# EAGLE design Mainboard-v18 (EAGLE 6.4)
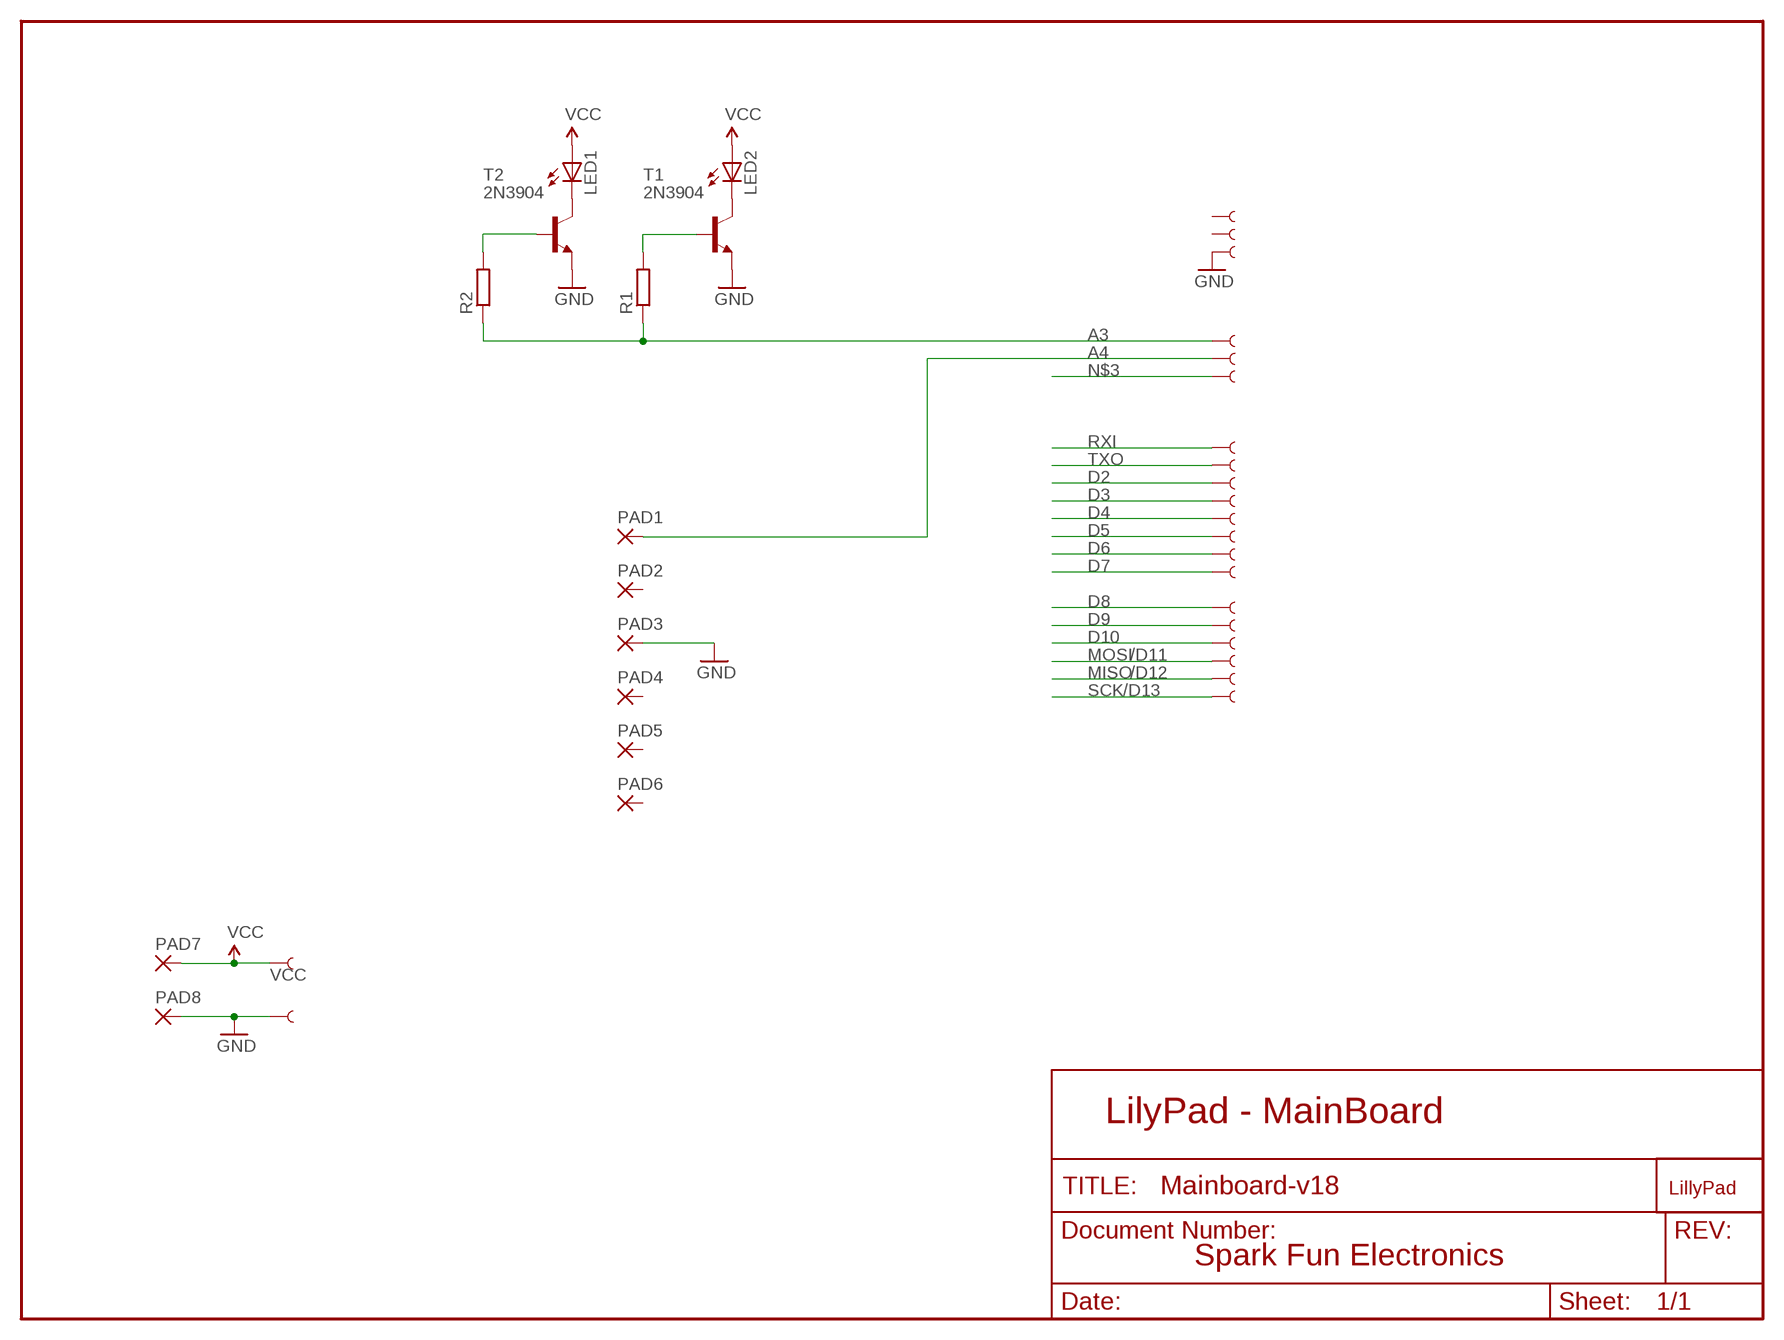
[diagram p0: schematic, sheet 1]

## Parts
GND  SEWTAP1  [SEWTAP]
LED1  LED5MM  [LED5MM]
LED2  LED5MM  [LED5MM]
PAD1  1,6/0,8  [1,6/0,8]
PAD2  1,6/0,8  [1,6/0,8]
PAD3  1,6/0,8  [1,6/0,8]
PAD4  1,6/0,8  [1,6/0,8]
PAD5  1,6/0,8  [1,6/0,8]
PAD6  1,6/0,8  [1,6/0,8]
PAD7  1,6/0,8  [1,6/0,8]
PAD8  1,6/0,8  [1,6/0,8]
R1  R-EU_0204/5  [0204/5]
R2  R-EU_0204/5  [0204/5]
T1  2N3904  [TO92]
T2  2N3904  [TO92]
U$1  LOGO-LPLPA  [LOGO-LPA]
U$4  SEWTAP1  [SEWTAP]
U$30  SEWTAP1  [SEWTAP]
U$31  SEWTAP1  [SEWTAP]
U$32  SEWTAP1  [SEWTAP]
U$33  SEWTAP1  [SEWTAP]
U$34  SEWTAP1  [SEWTAP]
U$35  SEWTAP1  [SEWTAP]
U$36  SEWTAP1  [SEWTAP]
U$37  SEWTAP1  [SEWTAP]
U$38  SEWTAP1  [SEWTAP]
U$39  SEWTAP1  [SEWTAP]
U$40  SEWTAP1  [SEWTAP]
U$41  SEWTAP1  [SEWTAP]
U$42  SEWTAP1  [SEWTAP]
U$43  SEWTAP1  [SEWTAP]
U$44  SEWTAP1  [SEWTAP]
U$45  SEWTAP1  [SEWTAP]
U$46  SEWTAP1  [SEWTAP]
U$47  SEWTAP1  [SEWTAP]
U$48  SEWTAP1  [SEWTAP]
U$51  SEWTAP1  [SEWTAP]

## Nets
A3: R1.1 R2.1 U$32.1
A4: PAD1.1(P) U$33.1
D2: U$45.1
D3: U$44.1
D4: U$43.1
D5: U$42.1
D6: U$41.1
D7: U$48.1
D8: U$35.1
D9: U$36.1
D10: U$37.1
GND: PAD3.1(P) PAD8.1(P) T1.3(E) T2.3(E) U$30.1 U$31.1
MISO: U$39.1
MOSI: U$38.1
N$1: LED1.K(C) T2.1(C)
N$2: LED2.K(C) T1.1(C)
N$3: U$34.1
N$4: R2.2 T2.2(B)
N$5: R1.2 T1.2(B)
RXI: U$47.1
SCK: U$40.1
TXO: U$46.1
VCC: LED1.A LED2.A PAD7.1(P) U$4.1
Unconnected: GND.1 PAD2.1(P) PAD4.1(P) PAD5.1(P) PAD6.1(P) U$51.1

## Notes on the sheet
- /D11
- /D12
- /D13
- LilyPad - MainBoard
- Spark Fun Electronics

## Library data of the parts
GND U$4 U$30-U$48 U$51 = LilyPad-Wearables:SEWTAP
LED1 LED2 = led:LED: LED OSRAM: - CHIPLED LG R971, LG N971, LY N971, LG Q971, LY Q971, LO R971, LY R971 LH N974, LH R974 LS Q976, LO Q976, LY Q976 LO Q996 - Hyper CHIPLED LW Q18S LB Q993, LB Q99A, LB R99A - SideLED LS A670, LO A670, LY A670, LG A670, LP A670 LB A673, LV A673, LT A673, LW A673 LH A674 LY A675 LS A676, LA A676, LO A676, LY A676, LW A676 LS A679, LY A679, LG A679 - Hyper Micro SIDELED® LS Y876, LA Y876, LO Y876, LY Y876 LT Y87S - SmartLED LW L88C, LW L88S LB L89C, LB L89S, LG L890 LS L89K, LO L89K, LY L89K LS L896, LA L896, LO L896, LY L896 - TOPLED LS T670, LO T670, LY T670, LG T670, LP T670 LSG T670, LSP T670, LSY T670, LOP T670, LYG T670 LG T671, LOG T671, LSG T671 LB T673, LV T673, LT T673, LW T673 LH T674 LS T676, LA T676, LO T676, LY T676, LB T676, LH T676, LSB T676, LW T676 LB T67C, LV T67C, LT T67C, LS T67K, LO T67K, LY T67K, LW E67C LS E67B, LA E67B, LO E67B, LY E67B, LB E67C, LV E67C, LT E67C LW T67C LS T679, LY T679, LG T679 LS T770, LO T770, LY T770, LG T770, LP T770 LB T773, LV T773, LT T773, LW T773 LH T774 LS E675, LA E675, LY E675, LS T675 LS T776, LA T776, LO T776, LY T776, LB T776 LHGB T686 LT T68C, LB T68C - Hyper Mini TOPLED® LB M676 - Mini TOPLED Santana® LG M470 LS M47K, LO M47K, LY M47K Source: http://www.osram.convergy.de LUXEON: - LUMILED® LXK2-PW12-R00, LXK2-PW12-S00, LXK2-PW14-U00, LXK2-PW14-V00 LXK2-PM12-R00, LXK2-PM12-S00, LXK2-PM14-U00 LXK2-PE12-Q00, LXK2-PE12-R00, LXK2-PE12-S00, LXK2-PE14-T00, LXK2-PE14-U00 LXK2-PB12-K00, LXK2-PB12-L00, LXK2-PB12-M00, LXK2-PB14-N00, LXK2-PB14-P00, LXK2-PB14-Q00 LXK2-PR12-L00, LXK2-PR12-M00, LXK2-PR14-Q00, LXK2-PR14-R00 LXK2-PD12-Q00, LXK2-PD12-R00, LXK2-PD12-S00 LXK2-PH12-R00, LXK2-PH12-S00 LXK2-PL12-P00, LXK2-PL12-Q00, LXK2-PL12-R00 Source: www.luxeon.com KINGBRIGHT: KA-3528ASYC Source: www.kingbright.com
PAD1-PAD8 = wirepad:1,6/0,8: THROUGH-HOLE PAD
R1 R2 = resistor:R-EU_: RESISTOR, European symbol
T1 T2 = transistor:2N3904: NPN TRANSISTOR
U$1 = LilyPad-Wearables:LOGO-LP

## Net classes
0 Default: width 0.203 mm, clearance 0.355 mm
1 VCC: width 0.305 mm

## Board
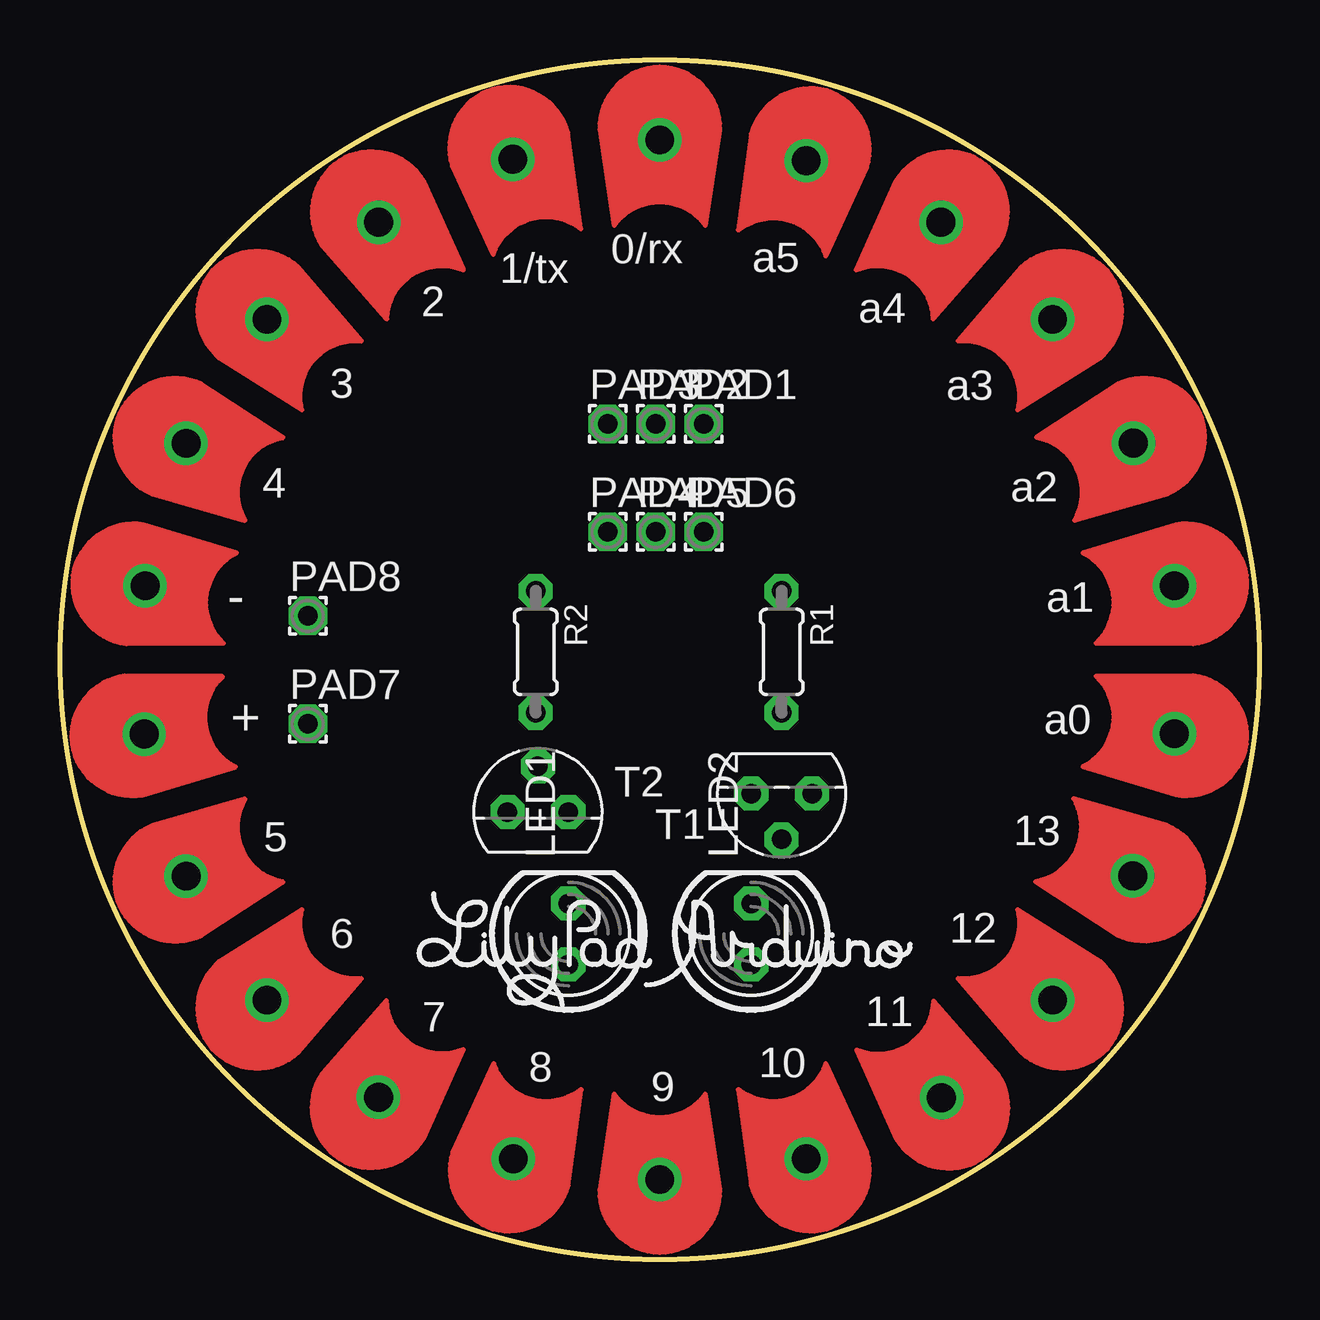
[diagram p1: board, top side]
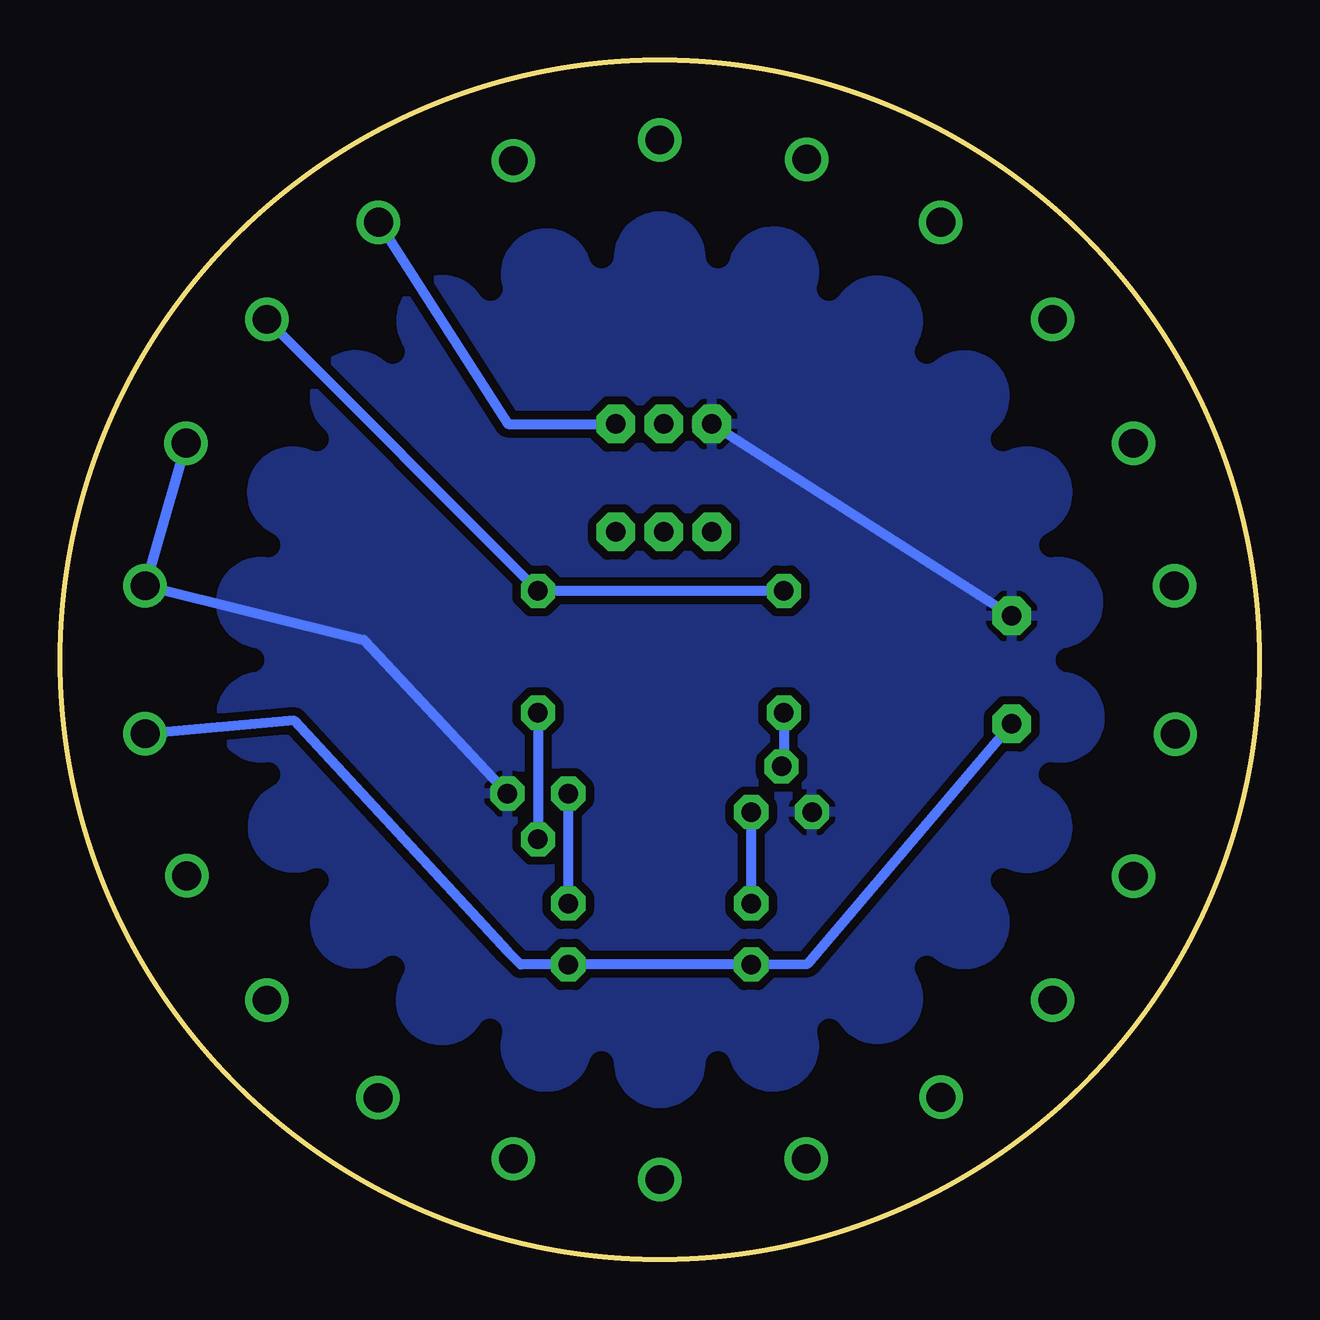
[diagram p2: board, bottom side, seen from below]

Size 50 x 50 mm. Coordinates in mm from the lower left corner, seen from the top.
Outline: circle at 25,25 radius 25
Copper layers (1*16): Top 0.035mm / dielectric 1.5mm / Bottom 0.035mm
Design rules "SparkFun *": minimum track width 8mil, minimum drill 20mil, track to track 8mil, track to pad 8mil, pad to pad 8mil, via to via 8mil, smd to smd 8mil, copper to edge 10mil, drill to drill 8mil, minimum pad ring 12mil, minimum via ring 10mil, stop-mask expansion 4mil, vias tented up to drill 20mil, thermal gap 10mil
bRestrict: area 2.4,2.4 to 47.6,47.6; area 21,42.8 to 23.5,44; area 31.6,41.3 to 34.4,43; area 36.3,38.4 to 38.9,40.7; area 40,34.1 to 42,36.9; area 42.2,29.2 to 43.6,31.8; area 42.8,23.9 to 44,26.2; area 42.2,18.2 to 43.7,20.9; area 36.3,9.4 to 39,11.7; area 31.7,7 to 34.5,8.7; area 26.5,6 to 28.9,7.3; area 21.1,6 to 23.6,7.3; area 15.6,7 to 18.3,8.7; area 11,9.3 to 13.8,11.6; area 8,13.1 to 10.1,15.9; area 6.4,18.2 to 8,20.8; area 6,23.7 to 7.2,26.2; area 6.3,29.1 to 7.9,31.7; area 8,34 to 10.1,36.9; area 11,38.3 to 13.7,40.6; area 15.4,41.2 to 18.4,43; area 26.4,42.5 to 29.1,44; area 40,13 to 42,16.1; 22 lines

### Footprints (pad centres in the part's own frame; a part is rotated, then mirrored left to right if it is on the bottom)
SEWTAP = drill 1.2: 1 0.03,0
LED5MM = drill 0.813 octagon: A -1.27,0; K 1.27,0
1,6/0,8 = drill 0.813 pad 1.6 octagon: 1 0,0
0204/5 = drill 0.813 octagon: 1 -2.54,0; 2 2.54,0
TO92 = drill 0.813 octagon: 1 1.27,0; 2 0,1.905; 3 -1.27,0

### Placement (x,y rotation side)
GND  3.52,28.09 351.8 top
LED1  21.19,13.57 90 top
LED2  28.81,13.57 90 top
PAD1  26.83,34.83 0 top
PAD2  24.83,34.83 0 top
PAD3  22.83,34.83 0 top
PAD4  22.83,30.33 0 top
PAD5  24.83,30.33 0 top
PAD6  26.83,30.33 0 top
PAD7  10.33,22.33 0 top
PAD8  10.33,26.83 0 top
R1  30.08,25.33 270 top
R2  19.83,25.33 270 top
T1  30.08,19.42 180 top
T2  19.92,18.65 0 top
U$1  25,13.3 0 top
U$4  46.48,21.91 171.8 top
U$30  46.48,28.09 188.2 top
U$31  44.77,34.04 204.5 top
U$32  41.4,39.21 220.9 top
U$33  36.74,43.26 237.3 top
U$34  31.11,45.83 253.7 top
U$35  18.89,4.17 73.7 top
U$36  25,3.3 90 top
U$37  31.11,4.17 106.3 top
U$38  36.76,6.72 122.7 top
U$39  41.4,10.79 139.1 top
U$40  44.74,15.98 155.5 top
U$41  8.6,10.79 40.9 top
U$42  5.23,15.97 24.5 top
U$43  5.23,34.03 335.5 top
U$44  8.6,39.21 319.1 top
U$45  13.27,43.26 302.7 top
U$46  18.87,45.89 286.3 top
U$47  25,46.7 270 top
U$48  13.26,6.74 57.3 top
U$51  3.48,21.9 8.2 top

### Tracks (layer width: path | path; a pad name or v marks a point on that pad's centre or on a via)
A3
  Bottom 0.406: R2.1 R1.1 U$32.1
A4
  Bottom 0.406: U$33.1 31.33,34.83 PAD1.1
GND
  Bottom 0.406: U$31.1 U$30.1 37.33,25.83 T1.3 | PAD3.1 PAD8.1
  pour Bottom (isolate 0.305): -1,51 51,51 51,-1 -1,-1
N$1
  Bottom 0.406: T2.1 LED1.K
N$2
  Bottom 0.406: LED2.K T1.1
N$4
  Bottom 0.406: R2.2 19.83,21.08 T2.2
N$5
  Bottom 0.406: R1.2 T1.2
VCC
  Bottom 0.406: U$4.1 40.24,22.46 31.33,12.83 30.8,12.3 LED2.A LED1.A 18.83,12.33 PAD7.1

### Text on the board
tPlace: 0/rx | a5 | 1/tx | 2 | a4 | 3 | a3 | 4 | a2 | - | a1 | + | a0 | 5 | 13 | 6 | 12 | 7 | 11 | 8 | 10 | 9